# Altium schematic sheet FlightController.SchDoc
size B; Revision: 5.3; SheetNumber: 1; SheetTotal: 6
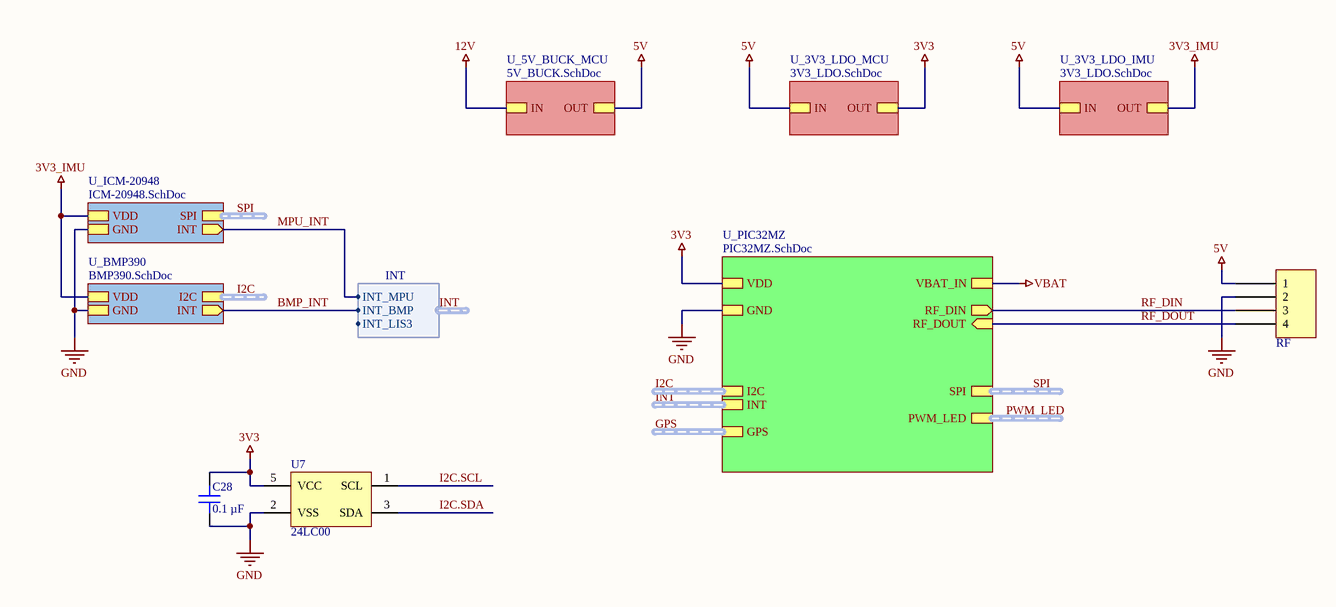
[diagram p0: FlightController.SchDoc]

## Parts
C28  0.1 µF  [CAP 0402_1005]
RF  SM04B-SRSS-TB(LF)(SN)  [JST SM04B-SRSS-TB]  (value not drawn)
U7  24LC00  [SOT-23-5]

## Sub-sheets
U_3V3_LDO_IMU = 3V3_LDO.SchDoc: OUT, IN
U_3V3_LDO_MCU = 3V3_LDO.SchDoc: OUT, IN
U_5V_BUCK_MCU = 5V_BUCK.SchDoc: OUT, IN
U_BMP390 = BMP390.SchDoc: VDD, GND, I2C (harness I2C), INT (out)
U_ICM-20948 = ICM-20948.SchDoc: VDD, GND, SPI (harness I2C), INT (out)
U_PIC32MZ = PIC32MZ.SchDoc: RF_DIN (out), RF_DOUT (in), GND, VDD, VBAT_IN, I2C (harness I2C), GPS (harness GPS), PWM_LED (harness PWM_LED), INT (harness INT), SPI (harness SPI)

## Harnesses
INT: INT_MPU, INT_BMP, INT_LIS3

## Nets
3V3: C28.2 U7.5(VCC) ; sheet U_PIC32MZ/VDD, sheet U_3V3_LDO_MCU/OUT
3V3_IMU: sheet U_3V3_LDO_IMU/OUT, sheet U_ICM-20948/VDD, sheet U_BMP390/VDD
5V: RF.1 ; sheet U_3V3_LDO_MCU/IN, sheet U_3V3_LDO_IMU/IN, sheet U_5V_BUCK_MCU/OUT
12V: sheet U_5V_BUCK_MCU/IN
GND: C28.1 RF.2 U7.2(VSS) ; sheet U_PIC32MZ/GND, sheet U_ICM-20948/GND, sheet U_BMP390/GND
VBAT: sheet U_PIC32MZ/VBAT_IN
BMP_INT: sheet U_BMP390/INT, sheet U_PIC32MZ/INT.INT_BMP
I2C.SCL: U7.1(SCL)
I2C.SDA: U7.3(SDA)
MPU_INT: sheet U_ICM-20948/INT, sheet U_PIC32MZ/INT.INT_MPU  [project net INT.INT_MPU]
RF_DIN: RF.3 ; sheet U_PIC32MZ/RF_DIN
RF_DOUT: RF.4 ; sheet U_PIC32MZ/RF_DOUT

## Buses and harness runs
harness GPS = sheet U_PIC32MZ/GPS
harness I2C = sheet U_BMP390/I2C
harness I2C = sheet U_PIC32MZ/I2C
harness INT = sheet U_PIC32MZ/INT
harness PWM_LED = sheet U_PIC32MZ/PWM_LED
harness SPI = sheet U_ICM-20948/SPI
harness SPI = sheet U_PIC32MZ/SPI

## Library data of the parts
C28 = C0402C104K4RACAUTO: CAP CER 0.1UF 16V X7R 0402; manufacturer: KEMET; Tolerance: ±10%; Part Number: C0402C104K4RACAUTO; Value: 0.1 µF; Applications: Automotive, Bypass, Decoupling; Capacitance: 0.1 µF; componentlink1description: Datasheet; componentlink1url: https://api.kemet.com/component-edge/download/specsheet/C0402C104K4RACAUTO.pdf; componentlink2description: DigiKey Link; componentlink2url: https://www.digikey.com/en/products/detail/kemet/C0402C104K4RACAUTO/3314827; Device Package: 0402 (1005 Metric); lastupdated: 8/14/2022 9:05:51 PM; Lifecycle Status: Active; Minimum Order: 1; Mounting Type: Surface Mount, MLCC; Operating Temperature: -55°C ~ 125°C; Package / Case: 0402 (1005 Metric); packaging: TapeAndReel; partid: 3024; Part Status: Active; price: 0.01; Ratings: AEC-Q200; series: SMD Auto X7R; Size / Dimension: 0.039" L x 0.020" W (1.00mm x 0.50mm); Supplier 1: DigiKey; Supplier Part Number 1: 399-6828-1-ND; Temperature Coefficient: X7R; Thickness (Max): 0.022" (0.55mm); Voltage - Rated: 16V
RF = SM04B-SRSS-TB(LF)(SN): CONN HEADER SMD R/A 4POS 1MM; Manufacturer: JST Sales America Inc.; Current Rating (Amps): 0.7A; Material Flammability Rating: UL94 V-0; Number of Positions: 4; Number of Positions Loaded: All; Pitch - Mating: 0.039" (1.00mm); Shrouding: Shrouded - 4 Wall; Style: Board to Cable/Wire; Voltage Rating: 50V; Part Number: SM04B-SRSS-TB(LF)(SN); ComponentLink1Description: Datasheet; ComponentLink1URL: http://www.jst-mfg.com/product/pdf/eng/eSH.pdf; ComponentLink2Description: DigiKey Link; ComponentLink2URL: http://digikey.com/product-detail/en/jst-sales-america-inc/SM04B-SRSS-TB-LF-SN/455-1804-1-ND/926875; Connector Type: Header; Contact Finish - Mating: Tin; Contact Finish - Post: Tin; Contact Material: Copper Alloy; Contact Shape: Square; Contact Type: Male Pin; Fastening Type: Push-Pull; Features: Solder Retention; Insulation Color: Natural; Insulation Height: 0.114" (2.90mm); Insulation Material: Polyamide (PA), Nylon; LastUpdated: 1/12/2020 11:41:52 PM; Lifecycle Status: Active; Minimum Order: 1; Mounting Type: Surface Mount, Right Angle; Number of Rows: 1; Operating Temperature: -25°C ~ 85°C; Packaging: TapeAndReel; PartId: 62; Part Status: Active; Price: 0.26; Series: SR; Supplier 1: DigiKey; Supplier Part Number 1: 455-1804-1-ND; Termination: Solder
U7 = 24LC00: EEPROM